# Altium project Xbee_Explorer_Coordinator.PrjPcb
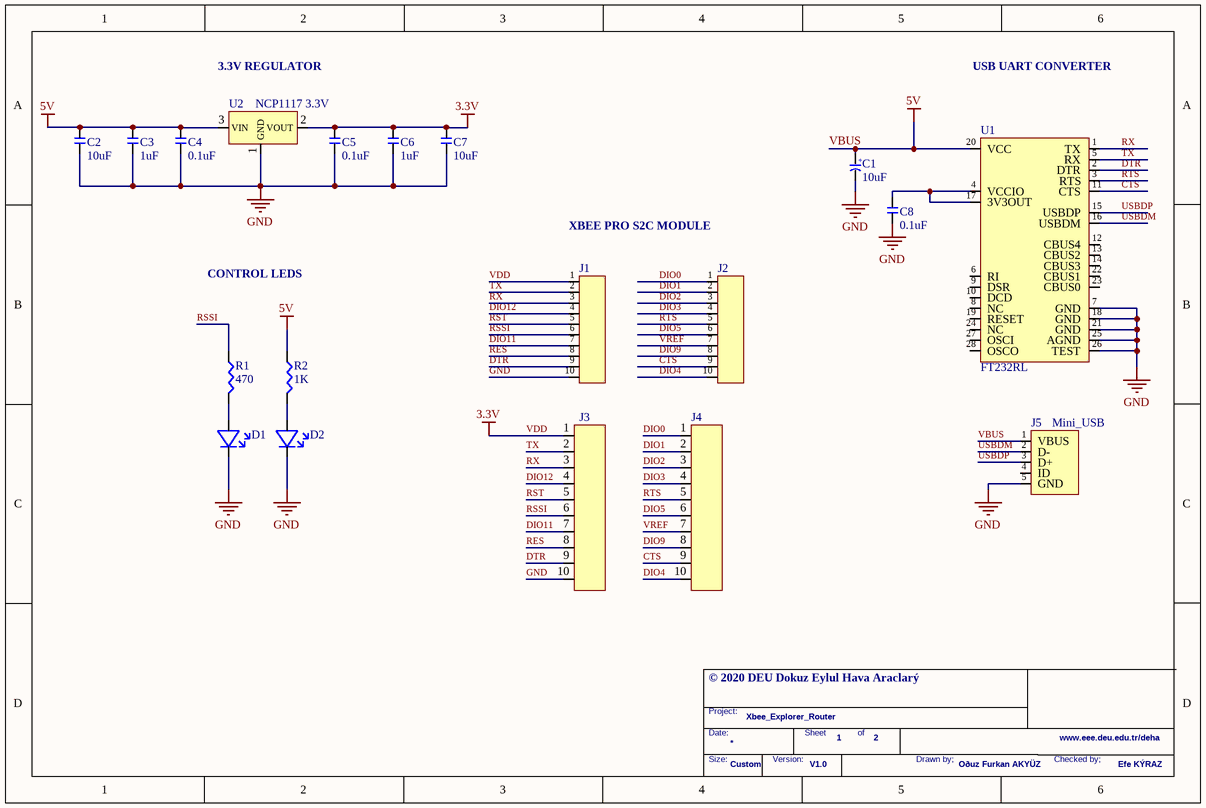
[diagram p0: Xbee_Coordinator.SchDoc]
Version: V1.0; Size: Custom; Project_Name: Xbee_Explorer_Router; Drawn_By: Oðuz Furkan AKYÜZ; Company_: © 2020 DEU Dokuz Eylul Hava Araclarý; Checked_By: Efe KÝRAZ
2 sheets, 37 parts. Net scope: global (net labels, ports and power ports of the same name join across sheets).
Board file: PCB1.PcbDoc
Sheets:
  Xbee_Coordinator.SchDoc
  Xbee_Router.SchDoc

## Sheet Xbee_Coordinator.SchDoc: Xbee Coordinator Explorer
size 224 x 149 mm; DocumentNumber: 1; Revision: V1.0; SheetNumber: 1; SheetTotal: 2

### Parts
(Parts that share a designator on the sheet are numbered #1, #2 ... from top to bottom, then left to right.)
*  TitleBlock  (value not drawn)  (graphical)
C1#1  10uF  [5x11 Radial Capacitor]
C2#1  10uF  [C_1206]
C3#1  1uF  [C_1206]
C4#1  0.1uF  [C_1206]
C5#1  0.1uF  [C_1206]
C6#1  1uF  [C_1206]
C7  10uF  [C_1206]
C8  0.1uF  [C_1206]
D1#1  LED_0805  [LED_0805]  (value not drawn)
D2#1  LED_0805  [LED_0805]  (value not drawn)
J1  Header_1x10_2mm  [Header 1x10 2mm]  (value not drawn)
J2  Header_1x10_2mm  [Header 1x10 2mm]  (value not drawn)
J3  Pin_Header_1x10Pos_2.54mm  [PinHeader_1x10Pin_2.54mm]  (value not drawn)
J4  Pin_Header_1x10Pos_2.54mm  [PinHeader_1x10Pin_2.54mm]  (value not drawn)
J5  Mini_USB  [Mini_USB]
R1#1  470  [R_1206]
R2#1  1K  [R_1206]
U1  FT232RL  [SSOP-28Pin]
U2  NCP1117 3.3V  [NCP1117 3.3V]

### Nets
3.3V: C5#1.2 C6#1.2 C7.2 J1.1 J3.1 U2.2(VOUT)  [also labelled VDD]
GND: C1#1.2 C2#1.1 C3#1.1 C4#1.1 C5#1.1 C6#1.1 C7.1 C8.1 D1#1.2 D2#1.2 J1.10 J3.10 J5.5(GND) U1.7(GND) U1.18(GND) U1.21(GND) U1.25(AGND) U1.26(TEST) U2.1(GND)
VBUS: C1#1.1 C2#1.2 C3#1.2 C4#1.2 J5.1(VBUS) R2#1.1 U1.20(VCC) U2.3(VIN)  [also labelled 5V]
CTS: J2.9 J4.9 U1.11(CTS)
DIO0: J2.1 J4.1
DIO1: J2.2 J4.2
DIO2: J2.3 J4.3
DIO3: J2.4 J4.4
DIO4: J2.10 J4.10
DIO5: J2.6 J4.6
DIO9: J2.8 J4.8
DIO11: J1.7 J3.7
DIO12: J1.4 J3.4
DTR: J1.9 J3.9 U1.2(DTR)
RES: J1.8 J3.8
RSSI: J1.6 J3.6 R1#1.1
RST: J1.5 J3.5
RTS: J2.5 J4.5 U1.3(RTS)
RX: J1.3 J3.3 U1.1(TX)
TX: J1.2 J3.2 U1.5(RX)
USBDM: J5.2(D-) U1.16(USBDM)
USBDP: J5.3(D+) U1.15(USBDP)
VREF: J2.7 J4.7
NetC8_2: C8.2 U1.4(VCCIO) U1.17(3V3OUT)
NetD1#1_1: D1#1.1 R1#1.2
NetD2#1_1: D2#1.1 R2#1.2

Not connected (* = marked no-connect by the designer): J5 4(ID); U1 6(RI) 8(NC) 9(DSR) 10(DCD) 12(CBUS4) 13(CBUS2) 14(CBUS3) 19(RESET) 22(CBUS1) 23(CBUS0) 24(NC) 27(OSCI) 28(OSCO)

### Notes on the sheet
- 3.3V REGULATOR
- USB UART CONVERTER
- CONTROL LEDS
- XBEE PRO S2C MODULE
- (in symbol Cap_Pol_5x11) +
- (in symbol TitleBlock) Project:; Date:; Sheet; of; www.eee.deu.edu.tr/deha; Size:; Version:; Drawn by;; Checked by;

### Library data of the parts
C1#1 = Cap_Pol_5x11: 5x11 Radial Polarized Capacitor
C2#1 C3#1 C4#1 C5#1 C6#1 C7 C8 = C_1206(3216): 1206(3216) package capacitor
R1#1 R2#1 = R_1206(3216): 1206(3216) package resistor
U1 = FT232RL: FT232RL_USB-Converter
U2 = NCP1117 3.3V: NCP1117-3.3V Linear Regulator

## Sheet Xbee_Router.SchDoc
size 250 x 149 mm; DocumentNumber: 2; SheetNumber: 2; SheetTotal: 2
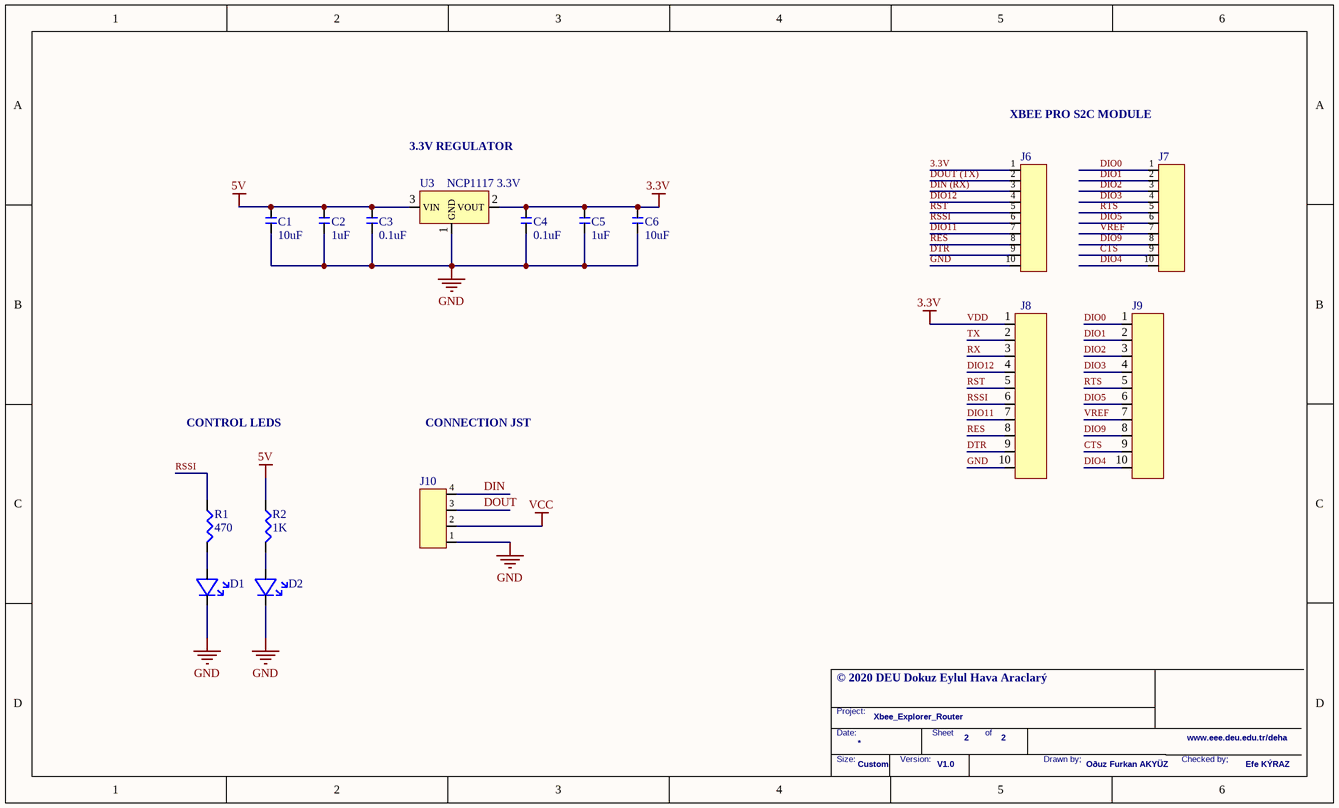
[diagram p1: Xbee_Router.SchDoc]

### Parts
(Parts that share a designator on the sheet are numbered #1, #2 ... from top to bottom, then left to right.)
*?  TitleBlock  (value not drawn)  (graphical)
C1#2  10uF  [C_1206]
C2#2  1uF  [C_1206]
C3#2  0.1uF  [C_1206]
C4#2  0.1uF  [C_1206]
C5#2  1uF  [C_1206]
C6#2  10uF  [C_1206]
D1#2  LED_0805  [LED_0805]  (value not drawn)
D2#2  LED_0805  [LED_0805]  (value not drawn)
J6  Header_1x10_2mm  [Header 1x10 2mm]  (value not drawn)
J7  Header_1x10_2mm  [Header 1x10 2mm]  (value not drawn)
J8  Pin_Header_1x10Pos_2.54mm  [PinHeader_1x10Pin_2.54mm]  (value not drawn)
J9  Pin_Header_1x10Pos_2.54mm  [PinHeader_1x10Pin_2.54mm]  (value not drawn)
J10  JST_Header_1x4Pos_2.54mm  [JST Header_1x4Pin_2.54mm]  (value not drawn)
R1#2  470  [R_1206]
R2#2  1K  [R_1206]
U3  NCP1117 3.3V  [NCP1117 3.3V]

### Nets
3.3V: C4#2.2 C5#2.2 C6#2.2 J6.1 J8.1 U3.2(VOUT)  [also labelled VDD]
5V: C1#2.2 C2#2.2 C3#2.2 R2#2.1 U3.3(VIN)  [project net VBUS]
GND: C1#2.1 C2#2.1 C3#2.1 C4#2.1 C5#2.1 C6#2.1 D1#2.2 D2#2.2 J6.10 J8.10 J10.1 U3.1(GND)
VCC: J10.2
CTS: J7.9 J9.9
DIN: J10.4
DIN (RX): J6.3
DIO0: J7.1 J9.1
DIO1: J7.2 J9.2
DIO2: J7.3 J9.3
DIO3: J7.4 J9.4
DIO4: J7.10 J9.10
DIO5: J7.6 J9.6
DIO9: J7.8 J9.8
DIO11: J6.7 J8.7
DIO12: J6.4 J8.4
DOUT: J10.3
DOUT (TX): J6.2
DTR: J6.9 J8.9
RES: J6.8 J8.8
RSSI: J6.6 J8.6 R1#2.1
RST: J6.5 J8.5
RTS: J7.5 J9.5
RX: J8.3
TX: J8.2
VREF: J7.7 J9.7
NetD1#2_1: D1#2.1 R1#2.2
NetD2#2_1: D2#2.1 R2#2.2

### Notes on the sheet
- 3.3V REGULATOR
- XBEE PRO S2C MODULE
- CONTROL LEDS
- CONNECTION JST
- (in symbol TitleBlock) Project:; Date:; Sheet; of; www.eee.deu.edu.tr/deha; Size:; Version:; Drawn by;; Checked by;

### Library data of the parts
C1#2 C2#2 C3#2 C4#2 C5#2 C6#2 = C_1206(3216): 1206(3216) package capacitor
R1#2 R2#2 = R_1206(3216): 1206(3216) package resistor
U3 = NCP1117 3.3V: NCP1117-3.3V Linear Regulator

## Nets that join several sheets
3.3V: Xbee_Coordinator (6 pins), Xbee_Router (6 pins)
GND: Xbee_Coordinator (19 pins), Xbee_Router (12 pins)
VBUS: Xbee_Coordinator (8 pins), Xbee_Router (5 pins)
CTS: Xbee_Coordinator (J2.9 J4.9 U1.11), Xbee_Router (J7.9 J9.9)
DIO0: Xbee_Coordinator (J2.1 J4.1), Xbee_Router (J7.1 J9.1)
DIO1: Xbee_Coordinator (J2.2 J4.2), Xbee_Router (J7.2 J9.2)
DIO2: Xbee_Coordinator (J2.3 J4.3), Xbee_Router (J7.3 J9.3)
DIO3: Xbee_Coordinator (J2.4 J4.4), Xbee_Router (J7.4 J9.4)
DIO4: Xbee_Coordinator (J2.10 J4.10), Xbee_Router (J7.10 J9.10)
DIO5: Xbee_Coordinator (J2.6 J4.6), Xbee_Router (J7.6 J9.6)
DIO9: Xbee_Coordinator (J2.8 J4.8), Xbee_Router (J7.8 J9.8)
DIO11: Xbee_Coordinator (J1.7 J3.7), Xbee_Router (J6.7 J8.7)
DIO12: Xbee_Coordinator (J1.4 J3.4), Xbee_Router (J6.4 J8.4)
DTR: Xbee_Coordinator (J1.9 J3.9 U1.2), Xbee_Router (J6.9 J8.9)
RES: Xbee_Coordinator (J1.8 J3.8), Xbee_Router (J6.8 J8.8)
RSSI: Xbee_Coordinator (J1.6 J3.6 R1#1.1), Xbee_Router (J6.6 J8.6 R1#2.1)
RST: Xbee_Coordinator (J1.5 J3.5), Xbee_Router (J6.5 J8.5)
RTS: Xbee_Coordinator (J2.5 J4.5 U1.3), Xbee_Router (J7.5 J9.5)
RX: Xbee_Coordinator (J1.3 J3.3 U1.1), Xbee_Router (J8.3)
TX: Xbee_Coordinator (J1.2 J3.2 U1.5), Xbee_Router (J8.2)
VREF: Xbee_Coordinator (J2.7 J4.7), Xbee_Router (J7.7 J9.7)